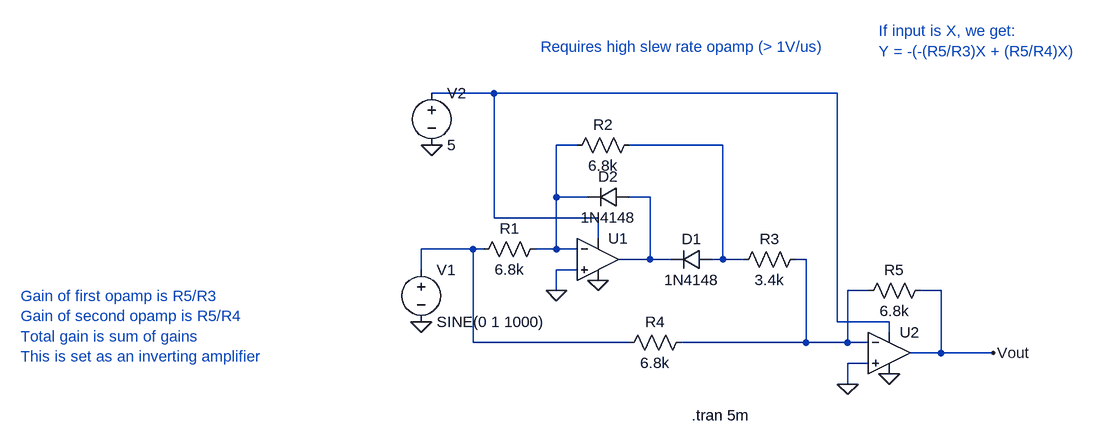
[diagram p0: schematic Full wave precision rectifier.asc]
Full wave precision rectifier.asc, the LTspice schematic file:
Version 4.1
SHEET 1 1112 680
WIRE 160 -144 64 -144
WIRE 688 -144 160 -144
WIRE 288 -64 256 -64
WIRE 512 -64 368 -64
WIRE 256 16 256 -64
WIRE 304 16 256 16
WIRE 400 16 368 16
WIRE 160 48 160 -144
WIRE 320 48 160 48
WIRE 320 80 320 48
WIRE 128 96 48 96
WIRE 144 96 128 96
WIRE 256 96 256 16
WIRE 256 96 224 96
WIRE 288 96 256 96
WIRE 400 112 400 16
WIRE 400 112 352 112
WIRE 432 112 400 112
WIRE 512 112 512 -64
WIRE 512 112 496 112
WIRE 544 112 512 112
WIRE 640 112 624 112
WIRE 48 128 48 96
WIRE 288 128 256 128
WIRE 256 160 256 128
WIRE 736 160 704 160
WIRE 848 160 816 160
WIRE 688 208 688 -144
WIRE 768 208 688 208
WIRE 768 224 768 208
WIRE 128 240 128 96
WIRE 368 240 128 240
WIRE 640 240 640 112
WIRE 640 240 448 240
WIRE 704 240 704 160
WIRE 704 240 640 240
WIRE 736 240 704 240
WIRE 848 256 848 160
WIRE 848 256 800 256
WIRE 928 256 848 256
WIRE 736 272 704 272
WIRE 704 304 704 272
FLAG 48 208 0
FLAG 256 160 0
FLAG 320 144 0
FLAG 704 304 0
FLAG 768 288 0
FLAG 928 256 Vout
FLAG 64 -64 0
SYMBOL voltage 48 112 R0
WINDOW 123 0 0 Left 0
WINDOW 39 0 0 Left 0
SYMATTR InstName V1
SYMATTR Value SINE(0 1 1000)
SYMBOL res 240 80 R90
WINDOW 0 0 56 VBottom 2
WINDOW 3 32 56 VTop 2
SYMATTR InstName R1
SYMATTR Value 6.8k
SYMBOL OpAmps\\UniversalOpAmp 320 112 R0
SYMATTR InstName U1
SYMBOL diode 496 96 R90
WINDOW 0 0 32 VBottom 2
WINDOW 3 32 32 VTop 2
SYMATTR InstName D1
SYMATTR Value 1N4148
SYMBOL diode 368 0 R90
WINDOW 0 0 32 VBottom 2
WINDOW 3 32 32 VTop 2
SYMATTR InstName D2
SYMATTR Value 1N4148
SYMBOL res 384 -80 R90
WINDOW 0 0 56 VBottom 2
WINDOW 3 32 56 VTop 2
SYMATTR InstName R2
SYMATTR Value 6.8k
SYMBOL res 640 96 R90
WINDOW 0 0 56 VBottom 2
WINDOW 3 32 56 VTop 2
SYMATTR InstName R3
SYMATTR Value 3.4k
SYMBOL OpAmps\\UniversalOpAmp 768 256 R0
SYMATTR InstName U2
SYMBOL res 464 224 R90
WINDOW 0 0 56 VBottom 2
WINDOW 3 32 56 VTop 2
SYMATTR InstName R4
SYMATTR Value 6.8k
SYMBOL res 832 144 R90
WINDOW 0 0 56 VBottom 2
WINDOW 3 32 56 VTop 2
SYMATTR InstName R5
SYMATTR Value 6.8k
SYMBOL voltage 64 -160 R0
SYMATTR InstName V2
SYMATTR Value 5
TEXT -568 168 Left 2 ;Gain of first opamp is R5/R3\nGain of second opamp is R5/R4\nTotal gain is sum of gains\nThis is set as an inverting amplifier
TEXT 232 -216 Left 2 ;Requires high slew rate opamp (> 1V/us)
TEXT 752 -240 Left 2 ;If input is X, we get:\nY = -(-(R5/R3)X + (R5/R4)X)
TEXT 464 352 Left 2 !.tran 5m

The netlist it stands for:
* Full wave precision rectifier.asc
V1 N005 0 SINE(0 1 1000)
R1 N002 N005 6.8k
X§U1 0 N002 N001 0 N004 level1 Avol=1Meg GBW=10Meg Vos=0 En=0 Enk=0 In=0 Ink=0 Rin=500Meg  ; pins In+ In- V+ V- OUT
D1 N003 N004 1N4148
D2 N004 N002 1N4148
R2 N003 N002 6.8k
R3 N006 N003 3.4k
X§U2 0 N006 N001 0 Vout level1 Avol=1Meg GBW=10Meg Vos=0 En=0 Enk=0 In=0 Ink=0 Rin=500Meg  ; pins In+ In- V+ V- OUT
R4 N006 N005 6.8k
R5 Vout N006 6.8k
V2 N001 0 5
.model D D
.lib standard.dio
* Gain of first opamp is R5/R3
* Gain of second opamp is R5/R4
* Total gain is sum of gains
* This is set as an inverting amplifier
* Requires high slew rate opamp (> 1V/us)
* If input is X, we get:
* Y = -(-(R5/R3)X + (R5/R4)X)
.tran 5m
.lib UniversalOpAmp1.lib
.backanno
.end